# EasyEDA schematic ble_car_cent_01.json
TITLE: Sheet_1; REV: 1.0; Date: 2022-04-23; Sheet: 1/1; Company: Your Company
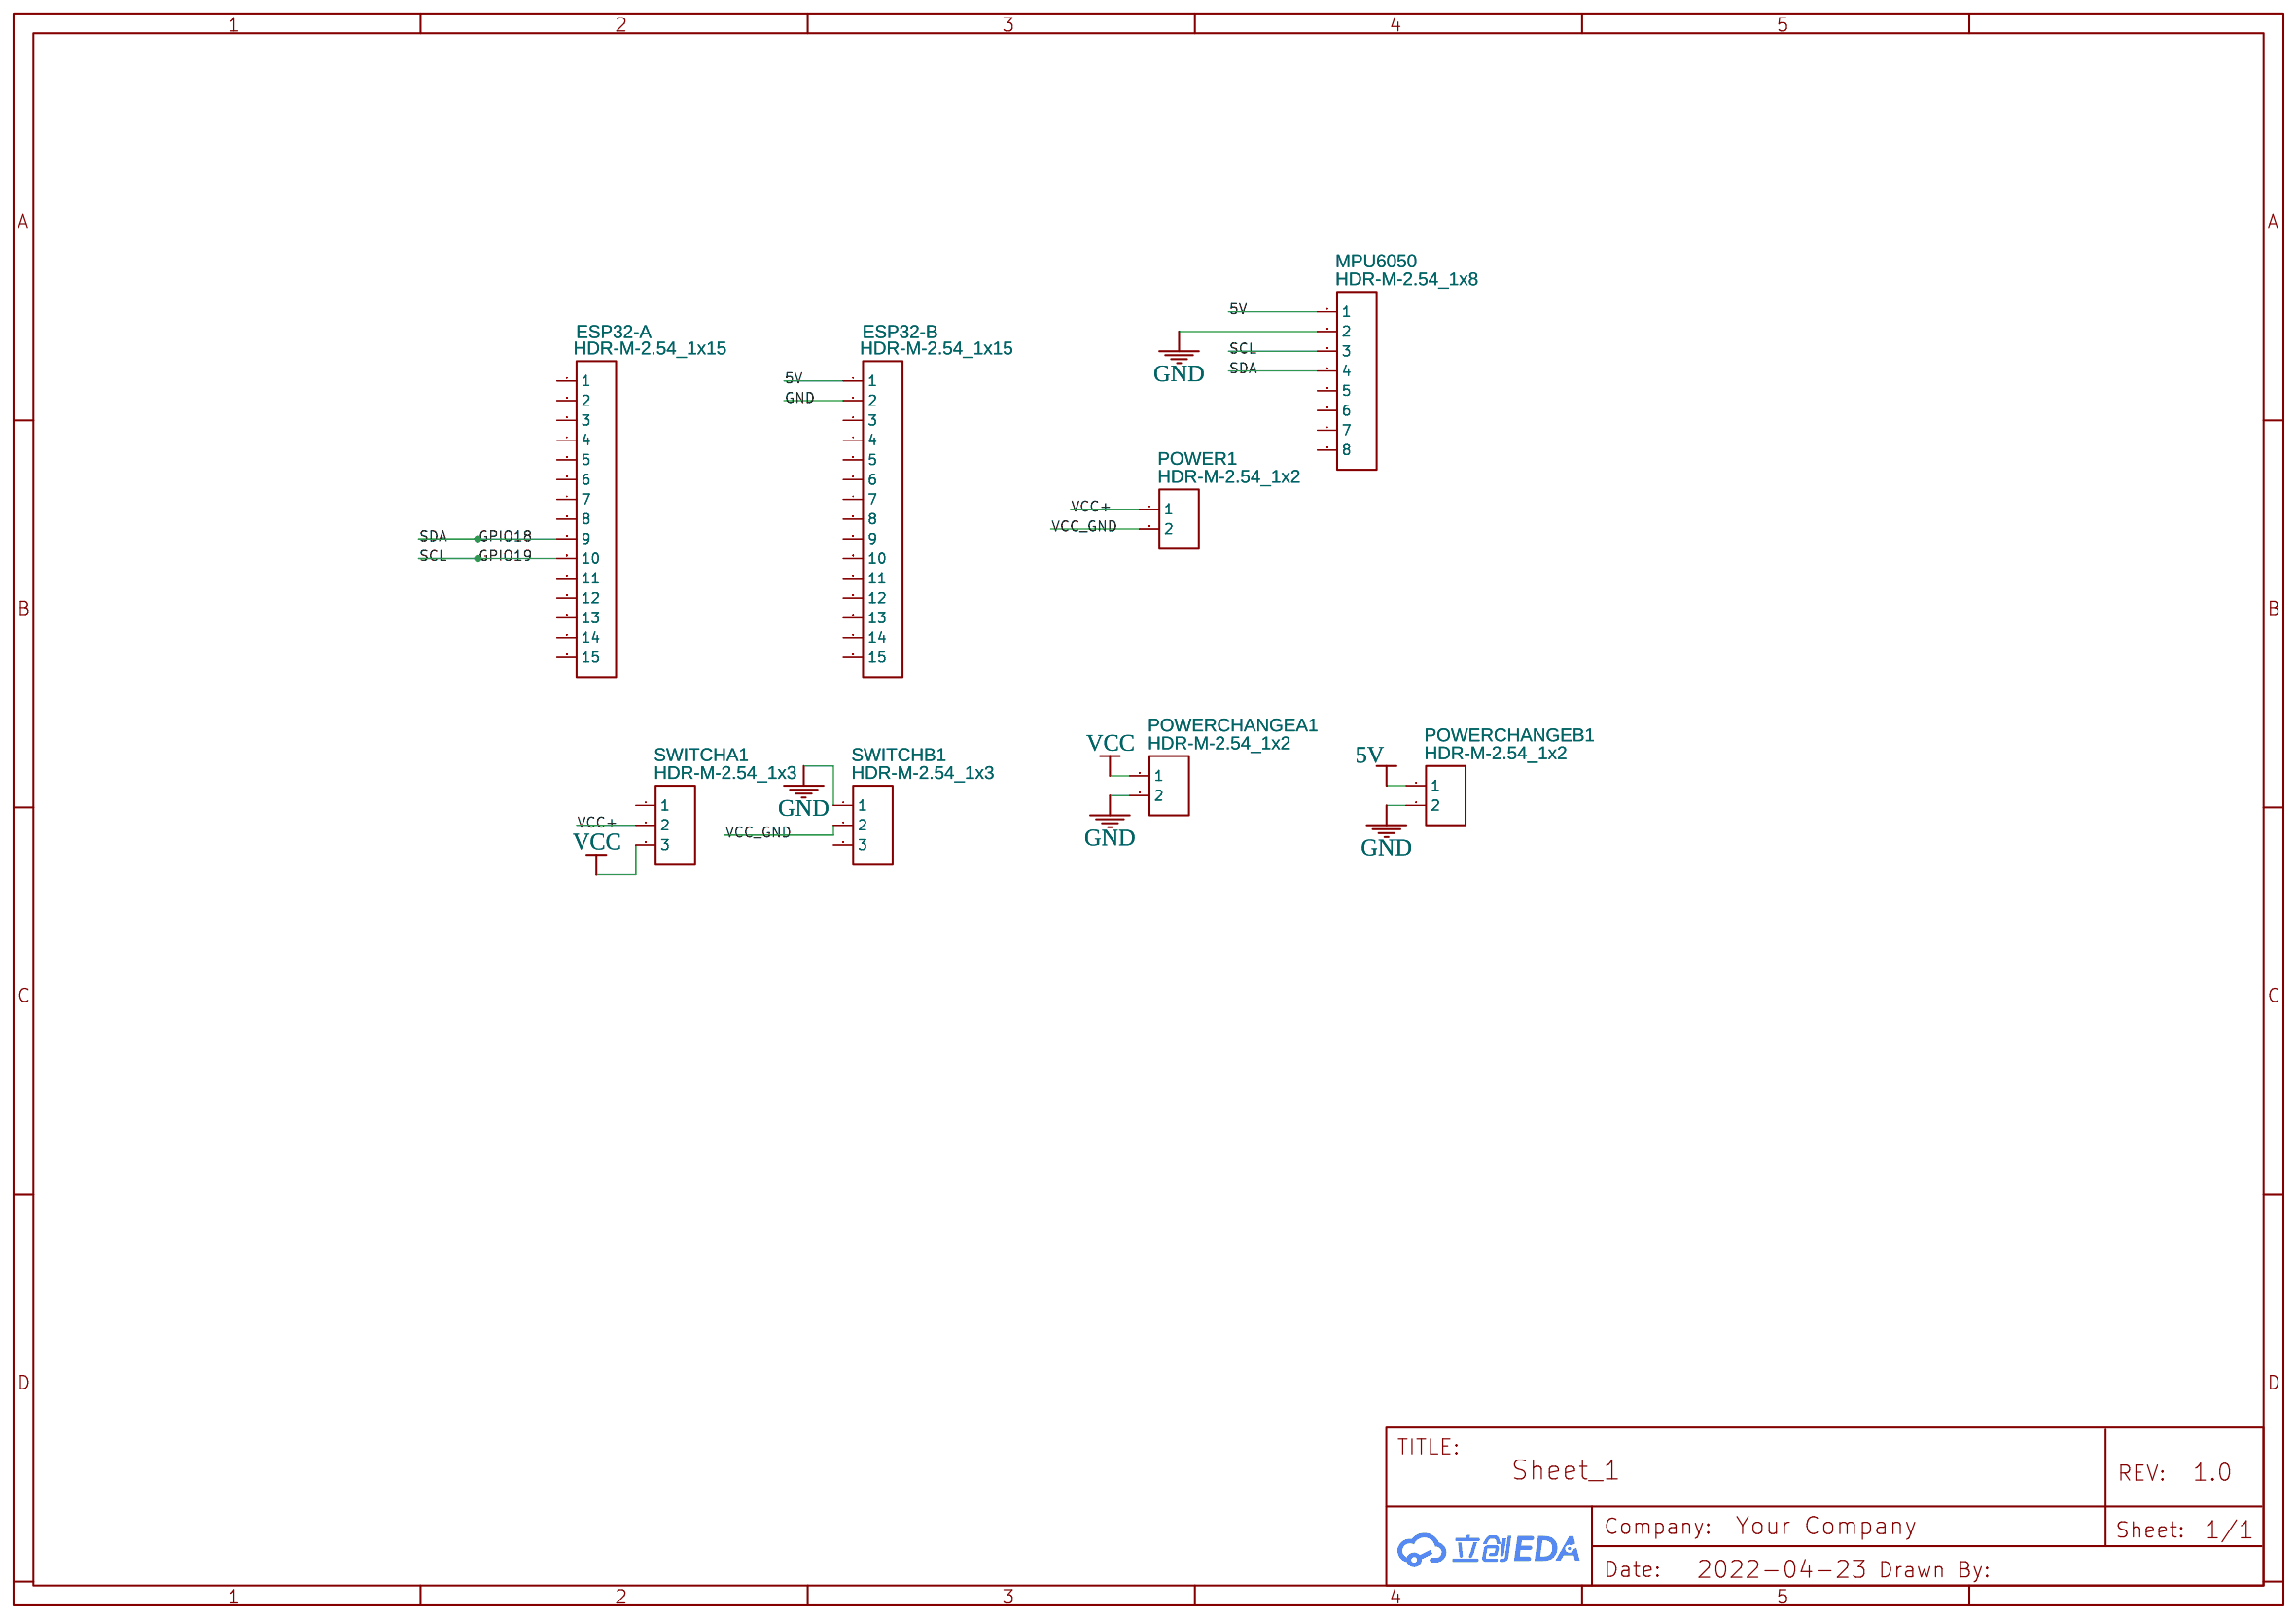
[diagram p0: schematic sheet]

## Parts
ESP32-A  HDR-M-2.54_1x15  [HDR-M-2.54_1X15]
ESP32-B  HDR-M-2.54_1x15  [HDR-M-2.54_1X15]
MPU6050  HDR-M-2.54_1x8  [HDR-M-2.54_1X8]
POWER1  HDR-M-2.54_1x2  [HDR-M-2.54_1X2]
POWERCHANGEA1  HDR-M-2.54_1x2  [HDR-M-2.54_1X2]
POWERCHANGEB1  HDR-M-2.54_1x2  [HDR-M-2.54_1X2]
SWITCHA1  HDR-M-2.54_1x3  [HDR-M-2.54_1X3]
SWITCHB1  HDR-M-2.54_1x3  [HDR-M-2.54_1X3]

## Library data of the parts
ESP32-A ESP32-B = HDR-M-2.54_1x15: Supplier Part: C124373; Supplier: LCSC; Contributor: LCEDA_Lib
MPU6050 = HDR-M-2.54_1x8: Supplier Part: C190820; Supplier: LCSC; Contributor: LCEDA_Lib
POWER1 POWERCHANGEA1 POWERCHANGEB1 = HDR-M-2.54_1x2: Supplier Part: C124375; Supplier: LCSC; Contributor: LCEDA_Lib
SWITCHA1 SWITCHB1 = HDR-M-2.54_1x3: Supplier Part: C180248; Supplier: LCSC; Contributor: LCEDA_Lib

## Nets
5V: ESP32-B.1 MPU6050.1 POWERCHANGEB1.1
GND: ESP32-B.2 MPU6050.2 POWERCHANGEA1.2 POWERCHANGEB1.2 SWITCHB1.1
VCC: POWERCHANGEA1.1 SWITCHA1.3
VCC+: POWER1.1 SWITCHA1.2
VCC_GND: POWER1.2 SWITCHB1.2
GPIO18: ESP32-A.9 MPU6050.4
GPIO19: ESP32-A.10 MPU6050.3

Not connected (* = marked no-connect by the designer): ESP32-A 1 2 3 4 5 6 7 8 11 12 13 14 15; ESP32-B 3 4 5 6 7 8 9 10 11 12 13 14 15; MPU6050 5 6 7 8; SWITCHA1 1; SWITCHB1 3
